# Altium schematic sheet RA64500_jc20_rotary2.SchDoc
size A4; DocumentType: Schematic; Size: A3
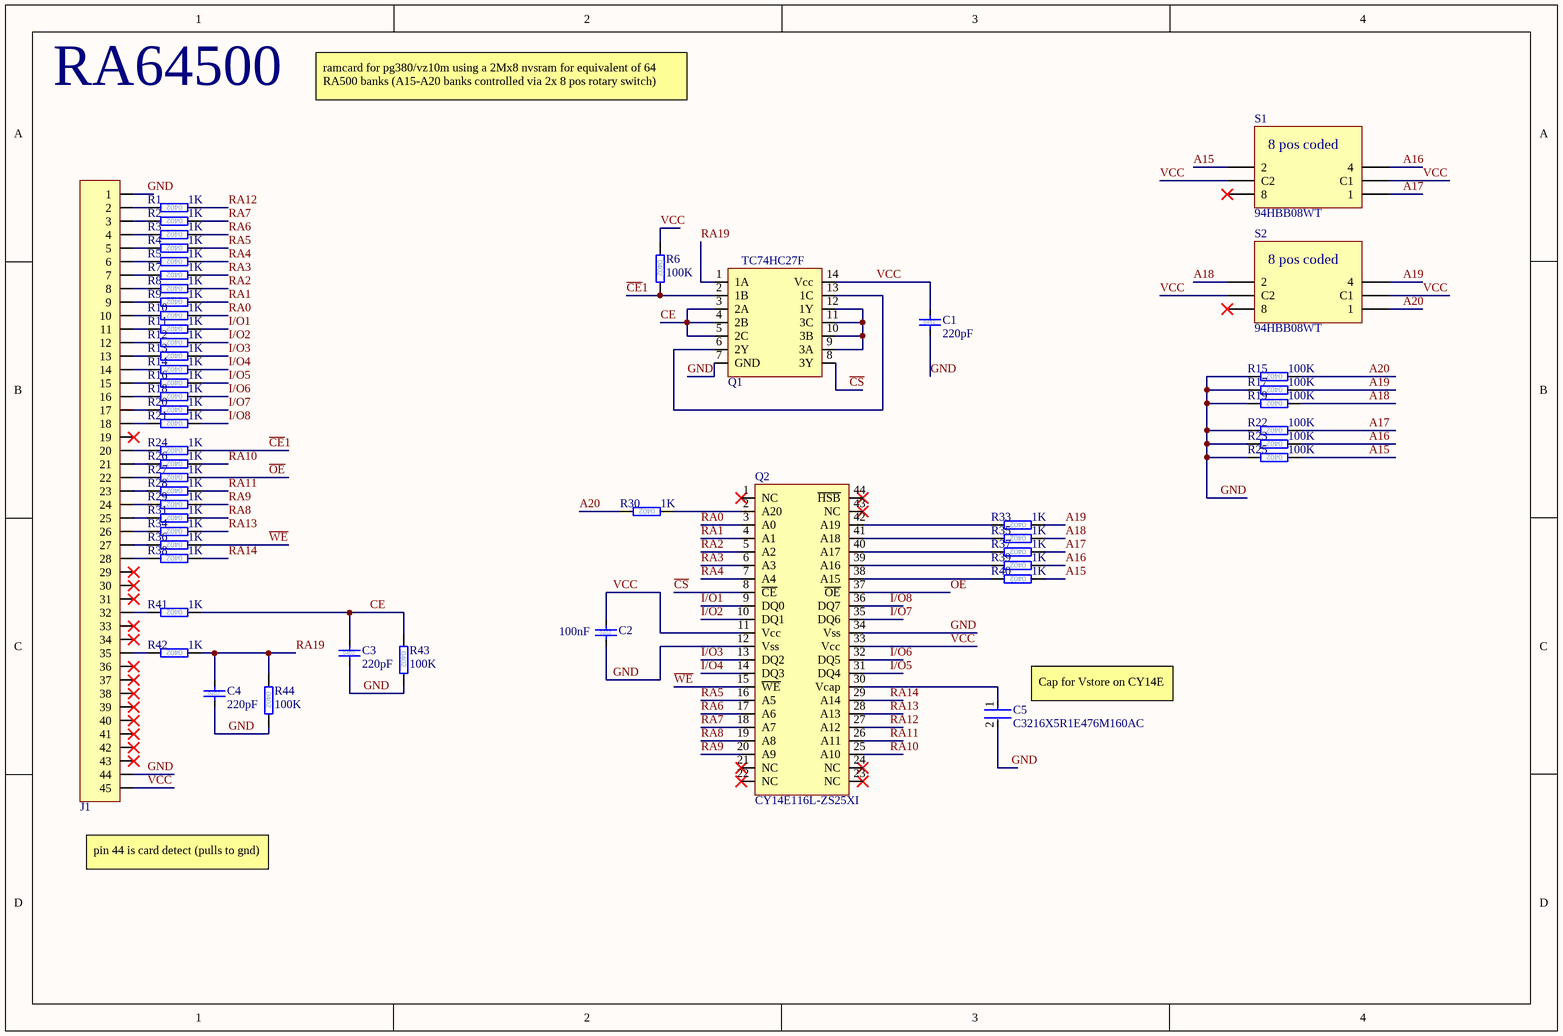
[diagram p0: RA64500_jc20_rotary2.SchDoc]

## Parts
C1  220pF  [0402]
C2  100nF  [0402]
C3  220pF  [0402]
C4  220pF  [0402]
C5  C3216X5R1E476M160AC  [FP-C3216-160-0_2-MFG]
J1  JC20-C45S-F1-A1  [JC20-C45S-F1-A1]  (value not drawn)
Q1  TC74HC27F  [SOP127P780X190-14N]
Q2  CY14E116L-ZS25XI  [SOP80P1183X119-44N]
R1  1K  [0402]
R2  1K  [0402]
R3  1K  [0402]
R4  1K  [0402]
R5  1K  [0402]
R6  100K  [0402]
R7  1K  [0402]
R8  1K  [0402]
R9  1K  [0402]
R10  1K  [0402]
R11  1K  [0402]
R12  1K  [0402]
R13  1K  [0402]
R14  1K  [0402]
R15  100K  [0402]
R16  1K  [0402]
R17  100K  [0402]
R18  1K  [0402]
R19  100K  [0402]
R20  1K  [0402]
R21  1K  [0402]
R22  100K  [0402]
R23  100K  [0402]
R24  1K  [0402]
R25  100K  [0402]
R26  1K  [0402]
R27  1K  [0402]
R28  1K  [0402]
R29  1K  [0402]
R30  1K  [0402]
R31  1K  [0402]
R33  1K  [0402]
R34  1K  [0402]
R35  1K  [0402]
R36  1K  [0402]
R37  1K  [0402]
R38  1K  [0402]
R39  1K  [0402]
R40  1K  [0402]
R41  1K  [0402]
R42  1K  [0402]
R43  100K  [0402]
R44  100K  [0402]
S1  94HBB08WT  [94HBB08WT]
S2  94HBB08WT  [94HBB08WT]

## Nets
A15: R25.1(R) R40.1(R) S1.4(2)
A16: R23.1(R) R39.1(R) S1.3(4)
A17: R22.1(R) R37.1(R) S1.1
A18: R19.1(R) R35.1(R) S2.4(2)
A19: R17.1(R) R33.1(R) S2.3(4)
A20: R15.1(R) R30.2(R) S2.1
~{CE}1: Q1.2(1B) R6.2(R) R24.1(R)
~{CS}: Q1.8(3Y) Q2.8(~{CE})
CE: C3.2 Q1.3(2A) Q1.4(2B) Q1.5(2C) R41.1(R) R43.1(R)
GND: C1.1 C2.1 C3.1 C4.1 C5.2 J1.1 J1.44 Q1.7(GND) Q2.12(Vss) Q2.34(Vss) R15.2(R) R17.2(R) R19.2(R) R22.2(R) R23.2(R) R25.2(R) R43.2(R) R44.2(R)
I/O1: Q2.9(DQ0) R11.1(R)
I/O2: Q2.10(DQ1) R12.1(R)
I/O3: Q2.13(DQ2) R13.1(R)
I/O4: Q2.14(DQ3) R14.1(R)
I/O5: Q2.31(DQ4) R16.1(R)
I/O6: Q2.32(DQ5) R18.1(R)
I/O7: Q2.35(DQ6) R20.1(R)
I/O8: Q2.36(DQ7) R21.1(R)
~{OE}: Q2.37(~{OE}) R27.1(R)
RA0: Q2.3(A0) R10.1(R)
RA1: Q2.4(A1) R9.1(R)
RA2: Q2.5(A2) R8.1(R)
RA3: Q2.6(A3) R7.1(R)
RA4: Q2.7(A4) R5.1(R)
RA5: Q2.16(A5) R4.1(R)
RA6: Q2.17(A6) R3.1(R)
RA7: Q2.18(A7) R2.1(R)
RA8: Q2.19(A8) R31.1(R)
RA9: Q2.20(A9) R29.1(R)
RA10: Q2.25(A10) R26.1(R)
RA11: Q2.26(A11) R28.1(R)
RA12: Q2.27(A12) R1.1(R)
RA13: Q2.28(A13) R34.1(R)
RA14: Q2.29(A14) R38.1(R)
RA19: C4.2 Q1.1(1A) R42.1(R) R44.1(R)
VCC: C1.2 C2.2 J1.45 Q1.14(Vcc) Q2.11(Vcc) Q2.33(Vcc) R6.1(R) S1.2(C1) S1.5(C2) S2.2(C1) S2.5(C2)
~{WE}: Q2.15(~{WE}) R36.1(R)
NetC5_1: C5.1 Q2.30(Vcap)
NetJ1_2: J1.2 R1.2(R)
NetJ1_3: J1.3 R2.2(R)
NetJ1_4: J1.4 R3.2(R)
NetJ1_5: J1.5 R4.2(R)
NetJ1_6: J1.6 R5.2(R)
NetJ1_7: J1.7 R7.2(R)
NetJ1_8: J1.8 R8.2(R)
NetJ1_9: J1.9 R9.2(R)
NetJ1_10: J1.10 R10.2(R)
NetJ1_11: J1.11 R11.2(R)
NetJ1_12: J1.12 R12.2(R)
NetJ1_13: J1.13 R13.2(R)
NetJ1_14: J1.14 R14.2(R)
NetJ1_15: J1.15 R16.2(R)
NetJ1_16: J1.16 R18.2(R)
NetJ1_17: J1.17 R20.2(R)
NetJ1_18: J1.18 R21.2(R)
NetJ1_20: J1.20 R24.2(R)
NetJ1_21: J1.21 R26.2(R)
NetJ1_22: J1.22 R27.2(R)
NetJ1_23: J1.23 R28.2(R)
NetJ1_24: J1.24 R29.2(R)
NetJ1_25: J1.25 R31.2(R)
NetJ1_26: J1.26 R34.2(R)
NetJ1_27: J1.27 R36.2(R)
NetJ1_28: J1.28 R38.2(R)
NetJ1_32: J1.32 R41.2(R)
NetJ1_35: J1.35 R42.2(R)
NetQ1_6: Q1.6(2Y) Q1.13(1C)
NetQ1_9: Q1.9(3A) Q1.10(3B) Q1.11(3C) Q1.12(1Y)
NetQ2_2: Q2.2(A20) R30.1(R)
NetQ2_38: Q2.38(A15) R40.2(R)
NetQ2_39: Q2.39(A16) R39.2(R)
NetQ2_40: Q2.40(A17) R37.2(R)
NetQ2_41: Q2.41(A18) R35.2(R)
NetQ2_42: Q2.42(A19) R33.2(R)

Not connected (* = marked no-connect by the designer): J1 19* 29* 30* 31* 33* 34* 36* 37* 38* 39* 40* 41* 42* 43*; Q2 1(NC)* 21(NC)* 22(NC)* 23(NC)* 24(NC)* 43(NC)* 44(~{HSB})*; S1 6(8)*; S2 6(8)*

## Notes on the sheet
- RA64500
- ramcard for pg380/vz10m using a 2Mx8 nvsram for equivalent of 64 RA500 banks (A15-A20 banks controlled via 2x 8 pos rotary switch)
- (near C5) Cap for Vstore on CY14E
- (near J1) pin 44 is card detect (pulls to gnd)
- REVISIONS
- REV
- CHANGE NOTES
- DATE
- @ CAMBRIONIX LIMITED / REFER TO PROTECTION NOTICE ISO 16016
- ENGINEER
- APPROVED
- TITLE
- PCB FILE LOCATION
- SIZE
- DOC. TYPE
- ASSEMBLY ID
- ASSEMBLY REV
- The Maurice Wilkes Building, Cowley Rd,
  Cambridge, CB4 0DS
- SHEET
- of
- (in symbol 94HBB08WT) 8 pos coded
- (in symbol 0402 Cap) 0402
- (in symbol 0402 Res) 0402

## Library data of the parts
C1 C3 C4 = 0402 Cap: 0402 220pF
C2 = 0402 Cap: 0402 100nF
C5 = CMP-2000-05397-3: Multilayer Ceramic Capacitors 47uF ±20% 25V X5R SMD 1206; Weight: 0.000571oz; Dielectric: X5R; Length: 0.126inch; Voltage Rating: 25V; Case/Package: 1206; Dielectric Material: Ceramic; Min Operating Temperature: -55°C; Lead Free: Lead Free; Packaging: Tape and Reel; Package Quantity: 1; Mount: Surface Mount; Depth: 1.6mm; REACH SVHC: No SVHC; Termination: SMD/SMT; Case Code (Imperial): 1206; Series: C; Resistor Type: Ceramic; Voltage: 25V; Width: 0.063inch; Height: 1.6mm; Tolerance: 20%; Capacitance: 47uF; Max Operating Temperature: 85°C; Voltage Rating (DC): 25V; RoHS Compliant: Yes; Thickness: 0.071inch; Case Code (Metric): 3216
J1 = JC20-C45S-F1-A1: 45 Pin 1mm pitch connector
Q1 = TC74HC27F: Triple 3-input NOR Gate
Q2 = CY14E116L-ZS25XI: 2Mx8 Bit nvSRAM
R1-R5 R7-R14 R16 R18 R20 R21 R24 R26-R31 R33-R42 = 0402 Res: 0402 1K
R6 R15 R17 R19 R22 R23 R25 R43 R44 = 0402 Res: 0402 100K
S1 S2 = 94HBB08WT: 8 pos rotary coded switch